# Altium schematic sheet 03) POWER SUPPLIES.SchDoc
size 447 x 332 mm
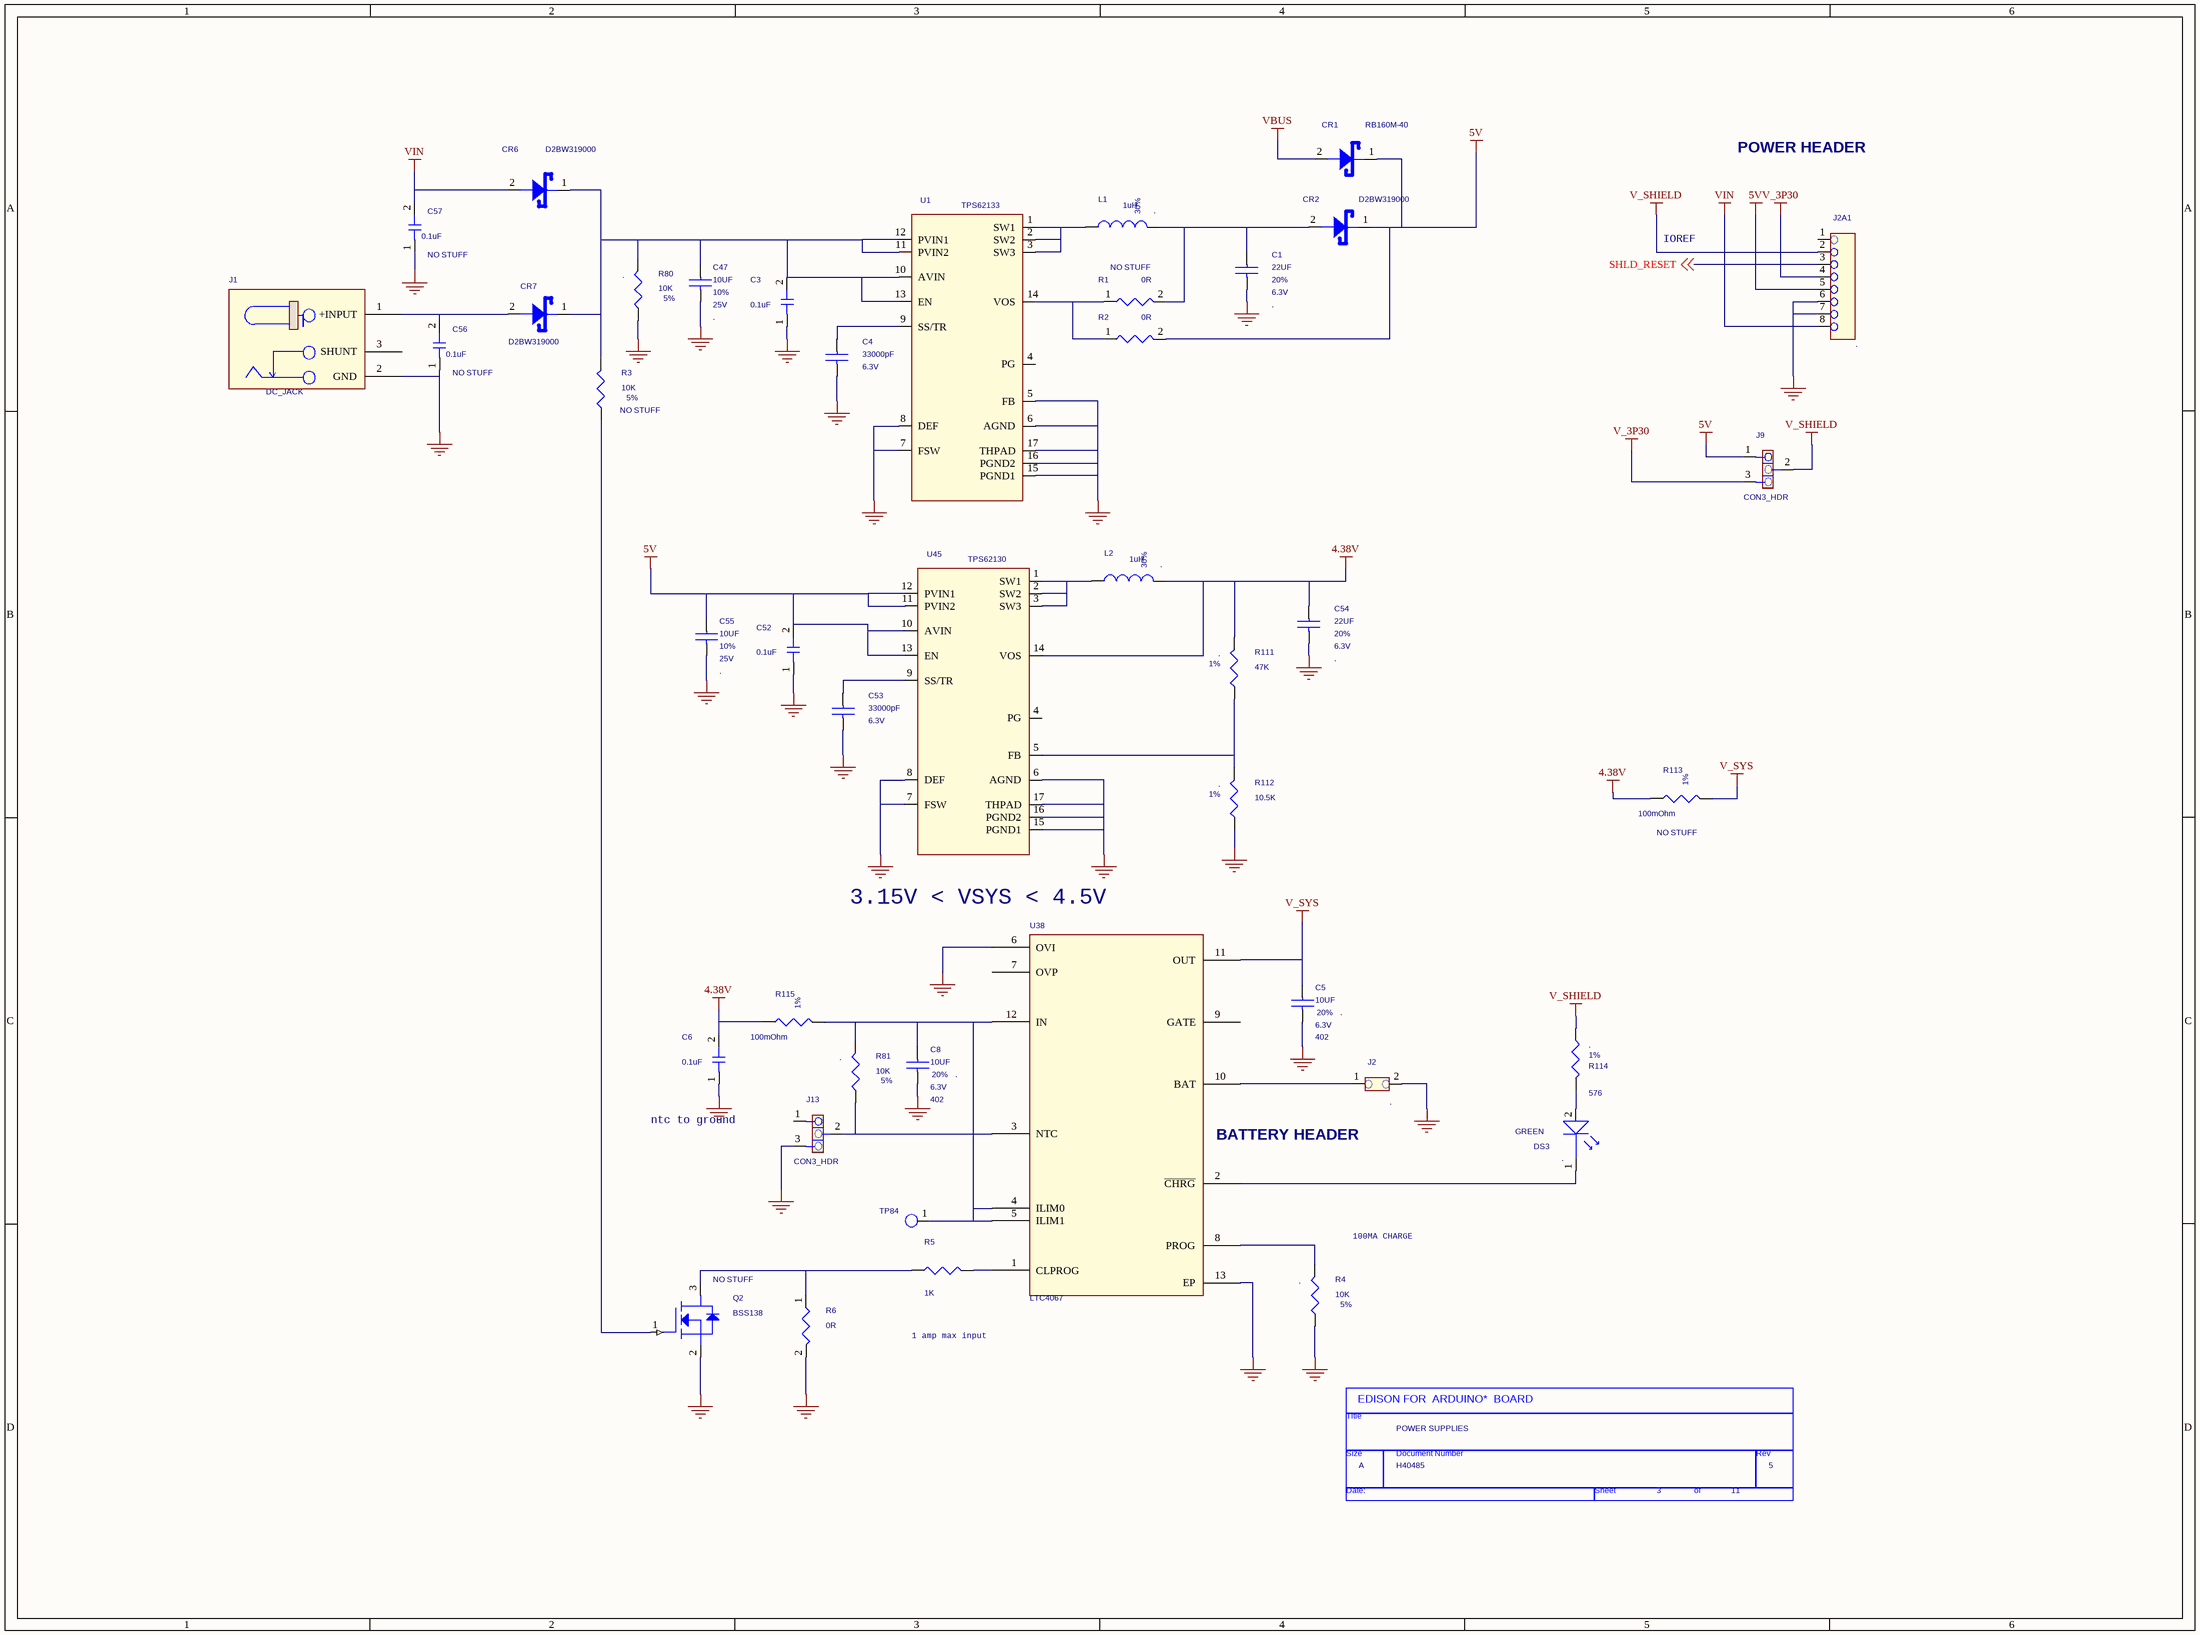
[diagram p0: 03) POWER SUPPLIES.SchDoc]

## Parts
*  Page Count: 11  Page Number: 3  Page Size: A  Title: POWER SUPPLIES  RevCode: 5  Doc: H40485  (hidden comment: TitleBlock0)  (graphical)
C1  22UF  TOLERANCE: 20%  RATING: 6.3V  NO_STUFF: .  [SMC0603_hi_value]
C3  0.1uF  [C0201]
C4  33000pF  RATING: 6.3V  [SMC0201]
C5  10UF  SIZE: 402  NO_STUFF: .  TOL: 20%  RATING: 6.3V  [SMC0402]
C6  0.1uF  [C0201]
C8  10UF  SIZE: 402  NO_STUFF: .  TOL: 20%  RATING: 6.3V  [SMC0402]
C47  10UF  RATING: 25V  NO_STUFF: .  TOL: 10%  [SMC0805_1p35h]
C52  0.1uF  [C0201]
C53  33000pF  RATING: 6.3V  [SMC0201]
C54  22UF  TOLERANCE: 20%  RATING: 6.3V  NO_STUFF: .  [SMC0603_hi_value]
C55  10UF  RATING: 25V  NO_STUFF: .  TOL: 10%  [SMC0805_1p35h]
C56  0.1uF  [C0201]
C57  0.1uF  [C0201]
CR1  RB160M-40  [SOD123_67x106]
CR2  D2BW319000  [SCR_27X17MA]
CR6  D2BW319000  [SCR_27X17MA]
CR7  D2BW319000  [SCR_27X17MA]
DS3  GREEN  NO_STUFF: .  [smled0402]
J1  DC_JACK  [JK_3P_RA]
J2  NO_STUFF: .  [102276-001]  (hidden comment: CON2_HDR)
J2A1  NO_STUFF: .  [1x8hdr_p100in_th]  (hidden comment: CON8_HDR)
J9  CON3_HDR  [1x3hdr_p100in_th]
J13  CON3_HDR  [1x3hdr_p100in_th]
L1  1uH  NO_STUFF: .  TOL: 30%  [SML0805]
L2  1uH  NO_STUFF: .  TOL: 30%  [SML0805]
Q2  BSS138  NO_STUFF: NO STUFF  [SOT23]
R1  0R  [0603.PRT]
R2  0R  [0603.PRT]
R3  10K  NO_STUFF: NO STUFF  TOL: 5%  [SMR0201]
R4  10K  NO_STUFF: .  TOL: 5%  [SMR0201]
R5  1K  [RC0603]
R6  0R  [0603.PRT]
R80  10K  NO_STUFF: .  TOL: 5%  [SMR0201]
R81  10K  NO_STUFF: .  TOL: 5%  [SMR0201]
R111  47K  TOL: 1%  NO_STUFF: .  [SMR0201]
R112  10.5K  TOL: 1%  NO_STUFF: .  [SMR0201]
R113  100mOhm  TOL: 1%  NO_STUFF: NO STUFF  [SMR0402]
R114  576  NO_STUFF: .  TOL: 1%  [SMR0201]
R115  100mOhm  TOL: 1%  [SMR0402]
TP84  30 MIL TESTPAD  [TESTPAD_C80]  (value not drawn)
U1  TPS62133  [QFN16_3X3]
U38  LTC4067  [lcc12_p5mm_3x4mm]
U45  TPS62130  [QFN16_3X3]

## Nets
4.38V: C6.2(END2) C54.1 L2.2 R111.2 R113.1 R115.1 U45.14(VOS)
5V: C52.2(END2) C55.1 CR1.1(Cathode) CR2.1(Cathode) J2A1.5 J9.1 R2.2 U45.10(AVIN) U45.11(PVIN2) U45.12(PVIN1) U45.13(EN)
GND: C1.2 C3.1(END1) C4.2 C5.2 C6.1(END1) C8.2 C47.2 C52.1(END1) C53.2 C54.2 C55.2 C56.1(END1) C57.1(END1) J1.2(GND) J2.2 J2A1.6 J2A1.7 J13.3 Q2.2(S) R4.1 R6.2 R80.1 R112.1 U1.5(FB) U1.6(AGND) U1.7(FSW) U1.8(DEF) U1.15(PGND1) U1.16(PGND2) U1.17(THPAD) U38.6(OVI) U38.13(EP) U45.6(AGND) U45.7(FSW) U45.8(DEF) U45.15(PGND1) U45.16(PGND2) U45.17(THPAD)
V_3P30: J2A1.4 J9.3
V_SHIELD: J2A1.2 J9.2 R114.2
V_SYS: C5.1 R113.2 U38.11(OUT)
VBUS: CR1.2(Anode)
VIN: C57.2(END2) CR6.2(Anode) J2A1.8
SHLD_RESET: J2A1.3 ; off-sheet SHLD_RESET
NetC1_1: C1.1 CR2.2(Anode) L1.2 R1.2
NetC3_2: C3.2(END2) C47.1 CR6.1(Cathode) CR7.1(Cathode) R3.2 R80.2 U1.10(AVIN) U1.11(PVIN2) U1.12(PVIN1) U1.13(EN)
NetC4_1: C4.1 U1.9(SS/TR)
NetC8_1: C8.1 R81.2 R115.2 TP84.1 U38.4(ILIM0) U38.5(ILIM1) U38.12(IN)
NetC53_1: C53.1 U45.9(SS/TR)
NetC56_2: C56.2(END2) CR7.2(Anode) J1.1(+INPUT)
NetDS3_1: DS3.1(LED1) U38.2(~{CHRG})
NetDS3_2: DS3.2(LED2) R114.1
NetJ2_1: J2.1 U38.10(BAT)
NetJ13_2: J13.2 R81.1 U38.3(NTC)
NetL1_1: L1.1 U1.1(SW1) U1.2(SW2) U1.3(SW3)
NetL2_1: L2.1 U45.1(SW1) U45.2(SW2) U45.3(SW3)
NetQ2_1: Q2.1(G) R3.1
NetQ2_3: Q2.3(D) R5.1 R6.1
NetR1_1: R1.1 R2.1 U1.14(VOS)
NetR4_2: R4.2 U38.8(PROG)
NetR5_2: R5.2 U38.1(CLPROG)
NetR111_1: R111.1 R112.2 U45.5(FB)

Not connected (* = marked no-connect by the designer): J1 3(SHUNT); J2A1 1; J13 1; U1 4(PG); U38 7(OVP) 9(GATE); U45 4(PG)

## Notes on the sheet
- POWER HEADER
- IOREF
- 3.15V < VSYS < 4.5V
- (near C6) ntc to ground
- (near U38) BATTERY HEADER
- 100MA CHARGE
- 1 amp max input
- (in symbol TitleBlock0) EDISON FOR  ARDUINO*  BOARD; Title; Size; Document Number; Rev; Date:; Sheet; of

## Library data of the parts
C1 C54 = CAPC,X5R,0603,6.3V,20%,22UF: CAPC,X5R,0603,22.000UF,6.300V,+/- 20%; Device: 602433-081; LEAD_FREE: YES; BOM: x; IPN: 602433-081; PART_NUMBER: 602433-081; FINANCE: x
C3 C57 = CAP: CAPC,X5R,0201,0.1UF,25.00V,+/- 10%; Manufacturer: GENERIC; PART_NUMBER: C83410-027; OriginalSymbolOrigin: (-50,50); Code: 27; Process: SMD; VOLTAGE: ?; PERC: ?; PATH: ?
  C57: NO STUFF: NO STUFF
C4 C53 = CAPC,X5R,0201,6.3V,10%,33000pF: CAPC,X5R,0201,0.033UF,6.3V,+/- 10%; PART_NUMBER: C83410-017; LEAD_FREE: YES; BOM: x; NO_STUFF: .; IPN: C83410-017; Device: C83410-017; FINANCE: x
C5 C8 = CAPC,X5R,0402,6.3V,20%,10uF: CAP C,10UF,0402,X5R,6.3V,+/-20%,; PART_NUMBER: A36096-114; Device: G21049-001; LEAD_FREE: YES; BOM: x; IPN: G21049-001; FINANCE: x
C6 C52 = CAP: CAPC,X5R,0201,0.1UF,10.00V,+/- 10%; PART_NUMBER: C83410-014; Manufacturer: GENERIC; OriginalSymbolOrigin: (-50,50); Process: SMD; Code: 27; VOLTAGE: ?; PERC: ?; PATH: ?
C47 C55 = CAPC,X7R,0805,50V,10%,1.0uF: CAPC,X5R,0805,10.00UF,25.00V,+/- 10%; FINANCE: x; LEAD_FREE: YES; IPN: G27061-002; BOM: x; Device: G27061-002; PART_NUMBER: G27061-002; PART NUMBER: G27061-002
C56 = CAP: CAPC,X5R,0201,0.1UF,25.00V,+/- 10%; PART_NUMBER: C83410-027; Manufacturer: GENERIC; OriginalSymbolOrigin: (-50,50); Process: SMD; Code: 27; VOLTAGE: ?; PERC: ?; PATH: ?; NO STUFF: NO STUFF
CR1 = DIO,SHTKY,SOD123,RB160M-40: DIODE SHKY 1A 40V SOD123; Manufacturer P/N: RM160M-40; Manufacturer: Pillips; FINANCE: x; LEAD_FREE: YES; IPN: E58800-001; NO_STUFF: .; Device: E58800-001; BOM: x; PART_NUMBER: E58800-001
CR2 CR6 CR7 = DIO,SHTKY,DB2W319000L: DIODE SHKY 1A 40V SOD123; PART NUMBER: H33384-001; Manufacturer: Pillips; Decsription: IC,DS,DIO,SMT,DB2W31900L,SHTKY,; FINANCE: x; LEAD_FREE: YES; NO_STUFF: .; Manufacturer P/N: DB2W319000L; IPN: H33384-001; Device: H33384-001; BOM: x; PART_NUMBER: H33384-001
DS3 = LED,SMT,GREEN,V,0402: LED,1005,SM,GRN,V,1.00,RC,1; Device: E54986-003; LEAD_FREE: YES; BOM: x; IPN: E54986-003; PART_NUMBER: E54986-003; FINANCE: x
J1 = TMP_091753: CONN,JACK,PWR,2.0MM,TH,PJ-002AH; MFR P/N: PJ-014D; MFR: CUI INC; PART_NUMBER: G60557-001; FINANCE: x; LEAD_FREE: YES; NO_STUFF: .; BOM: x; Device: G60557-001; IPN: G60557-001
J2 = CON2,HDR,TH,0.1in,A91829-020: CONN,HDR,1 X 2,PLG,VT,0.1,093ST,KP; PART_NUMBER: E81838-001; LEAD_FREE: YES; Device: E81838-001; IPN: E81838-001; BOM: x; FINANCE: x
J2A1 = CON8,HDR,TH,0.1in,E70026-001: CONN,PLUG,VERT,1X8,2.54MM,THM,90147_1108; FINANCE: x; LEAD_FREE: YES; IPN: H46118-001; BOM: x; Device: H46118-001; PART_NUMBER: H46118-001
J9 J13 = CON3,HDR,TH,0.1in,A91829-009: CONN,HDR,1 X 3,PLG,VT,0.1,062ST,KP; IPN: A91829-001; LEAD_FREE: YES; NO_STUFF: .; Device: A91829-001; BOM: x; FINANCE: x; PART_NUMBER: A91829-001
L1 L2 = INDCT,1uH,1.1A,30%,0805: INDCT,MTILAYER,1.00uH,1.1A,0805,30.0%,; MANUFACTURER P/N: MIPSZ2012D1R0; FINANCE: x; LEAD_FREE: YES; IPN: G95926-001; ROOM: NO_ROOM; MFG: Murata; BOM: x; Device: G95926-001; PART_NUMBER: G95926-001
Q2 = XSTR,BSS138,FET,NCH,SOT23: IC,DS,FET N,SOT-23,BSS138LT3G; FINANCE: x; LEAD_FREE: YES; Device: C81974-001; BOM: x; IPN: C81974-001; PART_NUMBER: C81974-001
R1 R6 = R_0: RES_D,0201,0.00OHM,1/20W; PART_NUMBER: C80792-009; Manufacturer: Yageo
  R1: NO STUFF: NO STUFF
R2 = R_0: RES_D,0201,0.00OHM,1/20W; Manufacturer: Yageo; PART_NUMBER: C80792-009
R3 R4 R80 R81 = RESD,0201,5%,1/20W,10K: RES D,0201,10.00 kOHM,5.00%,1/20W,YES; Device: C80792-002; BOM: x; ROOM: AUDIO_CODEC; RATING: 1/20W; IPN: C80792-002; PART_NUMBER: C80792-002; LEAD_FREE: YES; FINANCE: x
R5 = R0603: RES_D,0201,1.00kOHM,1.00%,1/20W; PART_NUMBER: C48657-010; Manufacturer: Yageo; Part Type: Resister
R111 = RESD,0201,1%,1/20W,47K: RES_D,0201,47.0kOHM,1.00%,1/20W,; PART_NUMBER: C48657-118; FINANCE: x; LEAD_FREE: YES; BOM: x; IPN: C48657-118; RATING: 1/20W; Device: C48657-118
R112 = RESD,0201,1%,1/20W,47K: RES_D,0201,10.50kOHM,1.00%,1/20W,; PART_NUMBER: C48657-088; FINANCE: x; LEAD_FREE: YES; BOM: x; IPN: C48657-088; RATING: 1/20W; Device: C48657-088
R113 R115 = RESD,0402,1%,1/16W,100mOhm: RES D,0402,0.10 OHM,1.00%,,1/16W; PART_NUMBER: C65288-008; LEAD_FREE: YES; BOM: x; IPN: C65288-008; RATING: 1/16W; Device: C65288-008; FINANCE: x
R114 = RESD,0201,1%,1/20W,562: RES D,0402,576.00 OHM,1.00%,1/16W,YES; PART_NUMBER: A93548-403; RATING: 1/20W; BOM: x; LEAD_FREE: YES; FINANCE: x
TP84 = TestPad,C80,SMT: LEAD_FREE: NO; FINANCE: x; IPN: TESTPAD_80; DEVICE: TESTPAD_30; ROOM: TEST_APE; BOM: x; PART_NUMBER: TESTPAD_30; NO_STUFF: NO_STUFF
U1 = TPS62133_0: IC,LIN,QFN,TPS62133,CONTROLR; Part_Number: H31879-001; PART NUMBER: H31879-001
U38 = IC,LTC4067,QFN12,USB_PWR_MNGR_1: C,LIN,DFN,LTC4067,CONTROLR; IPN: G38734-001; NO_STUFF: .; LEAD_FREE: YES; BOM: x; DEVICE: G38734-001; PART_NUMBER: G38734-001; FINANCE: x
U45 = TPS62133_0: IC,LIN,QFN,TPS62131,CONTROLR; PART NUMBER: G51818-004; Part_Number: G51818-004
* = TitleBlock0: Page Create Date: March  8, 1995